# EAGLE design counter (EAGLE 9.6.2)
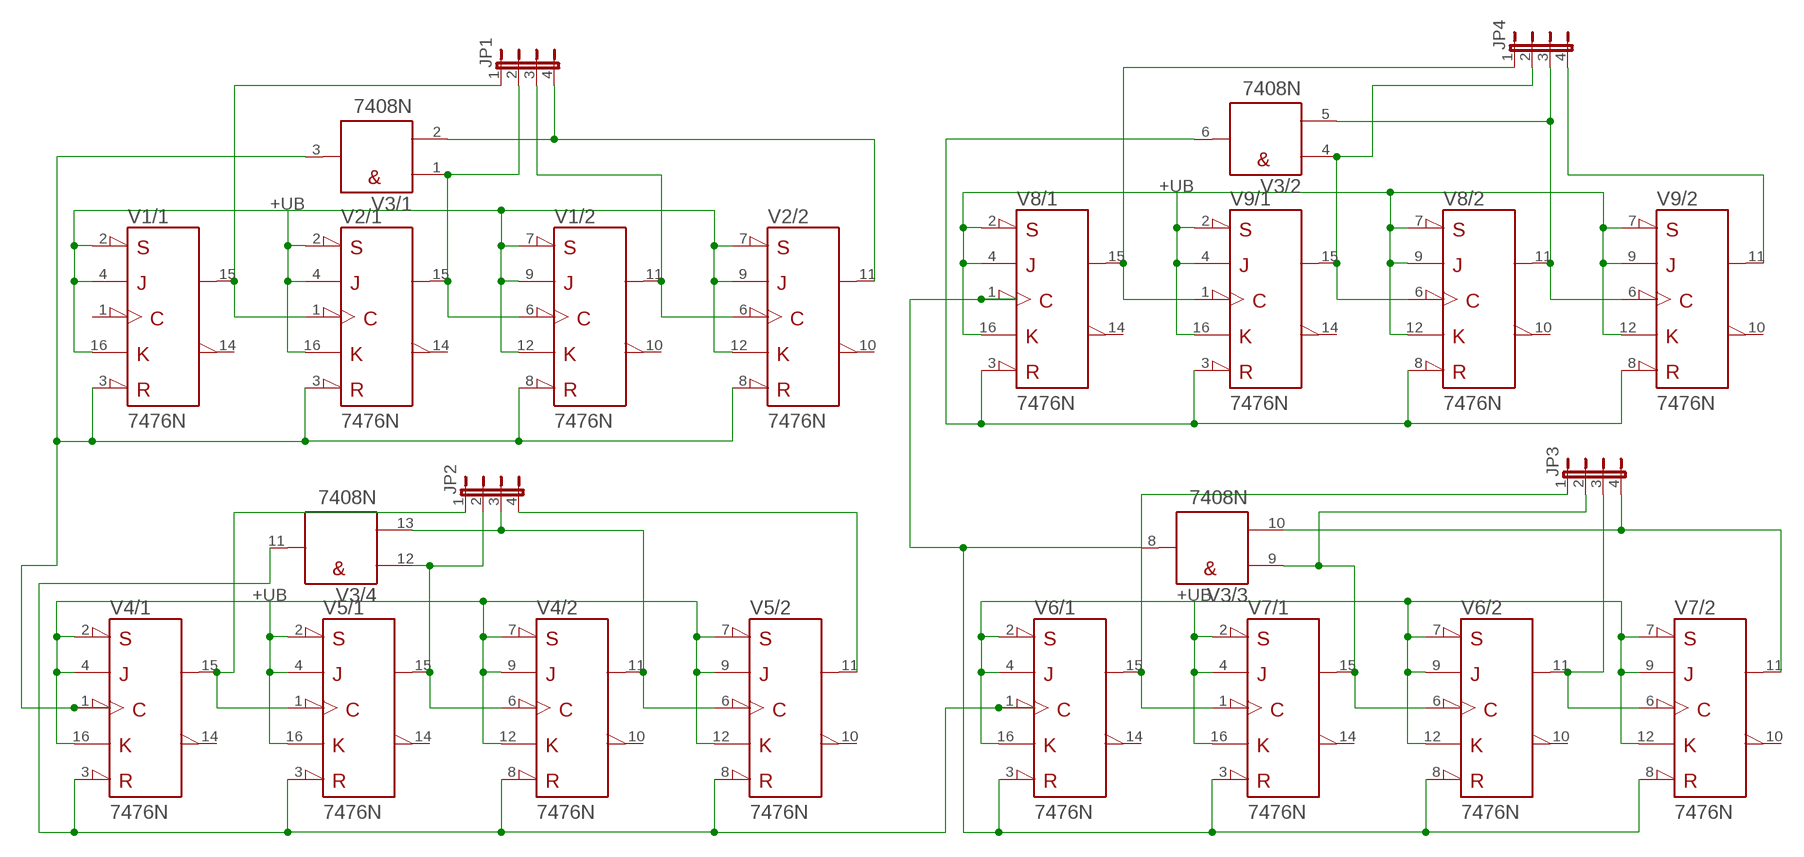
[diagram p0: schematic, sheet 1]

## Parts
JP1  JP4E  [JP4]
JP2  JP4E  [JP4]
JP3  JP4E  [JP4]
JP4  JP4E  [JP4]
V1  7476N  [DIL16]
V2  7476N  [DIL16]
V3  7408N  [DIL14]
V4  7476N  [DIL16]
V5  7476N  [DIL16]
V6  7476N  [DIL16]
V7  7476N  [DIL16]
V8  7476N  [DIL16]
V9  7476N  [DIL16]

## Nets
+UB: V1.2(/1:!PRE) V1.4(/1:J) V1.7(/2:!PRE) V1.9(/2:J) V1.12(/2:K) V1.16(/1:K) V2.2(/1:!PRE) V2.4(/1:J) V2.7(/2:!PRE) V2.9(/2:J) V2.12(/2:K) V2.16(/1:K) V4.2(/1:!PRE) V4.4(/1:J) V4.7(/2:!PRE) V4.9(/2:J) V4.12(/2:K) V4.16(/1:K) V5.2(/1:!PRE) V5.4(/1:J) V5.7(/2:!PRE) V5.9(/2:J) V5.12(/2:K) V5.16(/1:K) V6.2(/1:!PRE) V6.4(/1:J) V6.7(/2:!PRE) V6.9(/2:J) V6.12(/2:K) V6.16(/1:K) V7.2(/1:!PRE) V7.4(/1:J) V7.7(/2:!PRE) V7.9(/2:J) V7.12(/2:K) V7.16(/1:K) V8.2(/1:!PRE) V8.4(/1:J) V8.7(/2:!PRE) V8.9(/2:J) V8.12(/2:K) V8.16(/1:K) V9.2(/1:!PRE) V9.4(/1:J) V9.7(/2:!PRE) V9.9(/2:J) V9.12(/2:K) V9.16(/1:K)
N$1: JP1.1 V1.15(/1:Q) V2.1(/1:CLK)
N$2: JP1.2 V1.6(/2:CLK) V2.15(/1:Q) V3.1(/1:A)
N$3: V1.3(/1:!CLR) V1.8(/2:!CLR) V2.3(/1:!CLR) V2.8(/2:!CLR) V3.3(/1:Y) V4.1(/1:CLK)
N$4: JP1.3 V1.11(/2:Q) V2.6(/2:CLK)
N$5: JP1.4 V2.11(/2:Q) V3.2(/1:B)
N$6: JP3.4 V3.10(/3:B) V7.11(/2:Q)
N$7: V3.11(/4:Y) V4.3(/1:!CLR) V4.8(/2:!CLR) V5.3(/1:!CLR) V5.8(/2:!CLR) V6.1(/1:CLK)
N$8: JP2.1 V4.15(/1:Q) V5.1(/1:CLK)
N$9: JP2.2 V3.12(/4:A) V4.6(/2:CLK) V5.15(/1:Q)
N$10: JP2.3 V3.13(/4:B) V4.11(/2:Q) V5.6(/2:CLK)
N$11: JP2.4 V5.11(/2:Q)
N$12: V3.6(/2:Y) V8.3(/1:!CLR) V8.8(/2:!CLR) V9.3(/1:!CLR) V9.8(/2:!CLR)
N$13: V3.8(/3:Y) V6.3(/1:!CLR) V6.8(/2:!CLR) V7.3(/1:!CLR) V7.8(/2:!CLR) V8.1(/1:CLK)
N$14: JP3.1 V6.15(/1:Q) V7.1(/1:CLK)
N$15: JP3.2 V3.9(/3:A) V6.6(/2:CLK) V7.15(/1:Q)
N$16: JP3.3 V6.11(/2:Q) V7.6(/2:CLK)
N$17: JP4.1 V8.15(/1:Q) V9.1(/1:CLK)
N$18: JP4.4 V9.11(/2:Q)
N$19: JP4.3 V3.5(/2:B) V8.11(/2:Q) V9.6(/2:CLK)
N$23: JP4.2 V3.4(/2:A) V8.6(/2:CLK) V9.15(/1:Q)
Unconnected: V1.1(/1:CLK) V1.10(/2:!Q) V1.14(/1:!Q) V2.10(/2:!Q) V2.14(/1:!Q) V4.10(/2:!Q) V4.14(/1:!Q) V5.10(/2:!Q) V5.14(/1:!Q) V6.10(/2:!Q) V6.14(/1:!Q) V7.10(/2:!Q) V7.14(/1:!Q) V8.10(/2:!Q) V8.14(/1:!Q) V9.10(/2:!Q) V9.14(/1:!Q)

## Power pins joined to a net without a drawn wire
+UB: V1.5(/+UB:+UB) V2.5(/+UB:+UB) V3.14(/+UB:+UB) V4.5(/+UB:+UB) V5.5(/+UB:+UB) V6.5(/+UB:+UB) V7.5(/+UB:+UB) V8.5(/+UB:+UB) V9.5(/+UB:+UB)
-UB: V1.13(/-UB:-UB) V2.13(/-UB:-UB) V3.7(/-UB:-UB) V4.13(/-UB:-UB) V5.13(/-UB:-UB) V6.13(/-UB:-UB) V7.13(/-UB:-UB) V8.13(/-UB:-UB) V9.13(/-UB:-UB)

## Library data of the parts
JP1-JP4 = jumper:JP4E: JUMPER
V1 V2 V4-V9 = 74ttl-din:74*76: Dual J-K FLIP FLOP, preset and clear
V3 = 74ttl-din:74*08: Quad 2-input AND gate

## Board
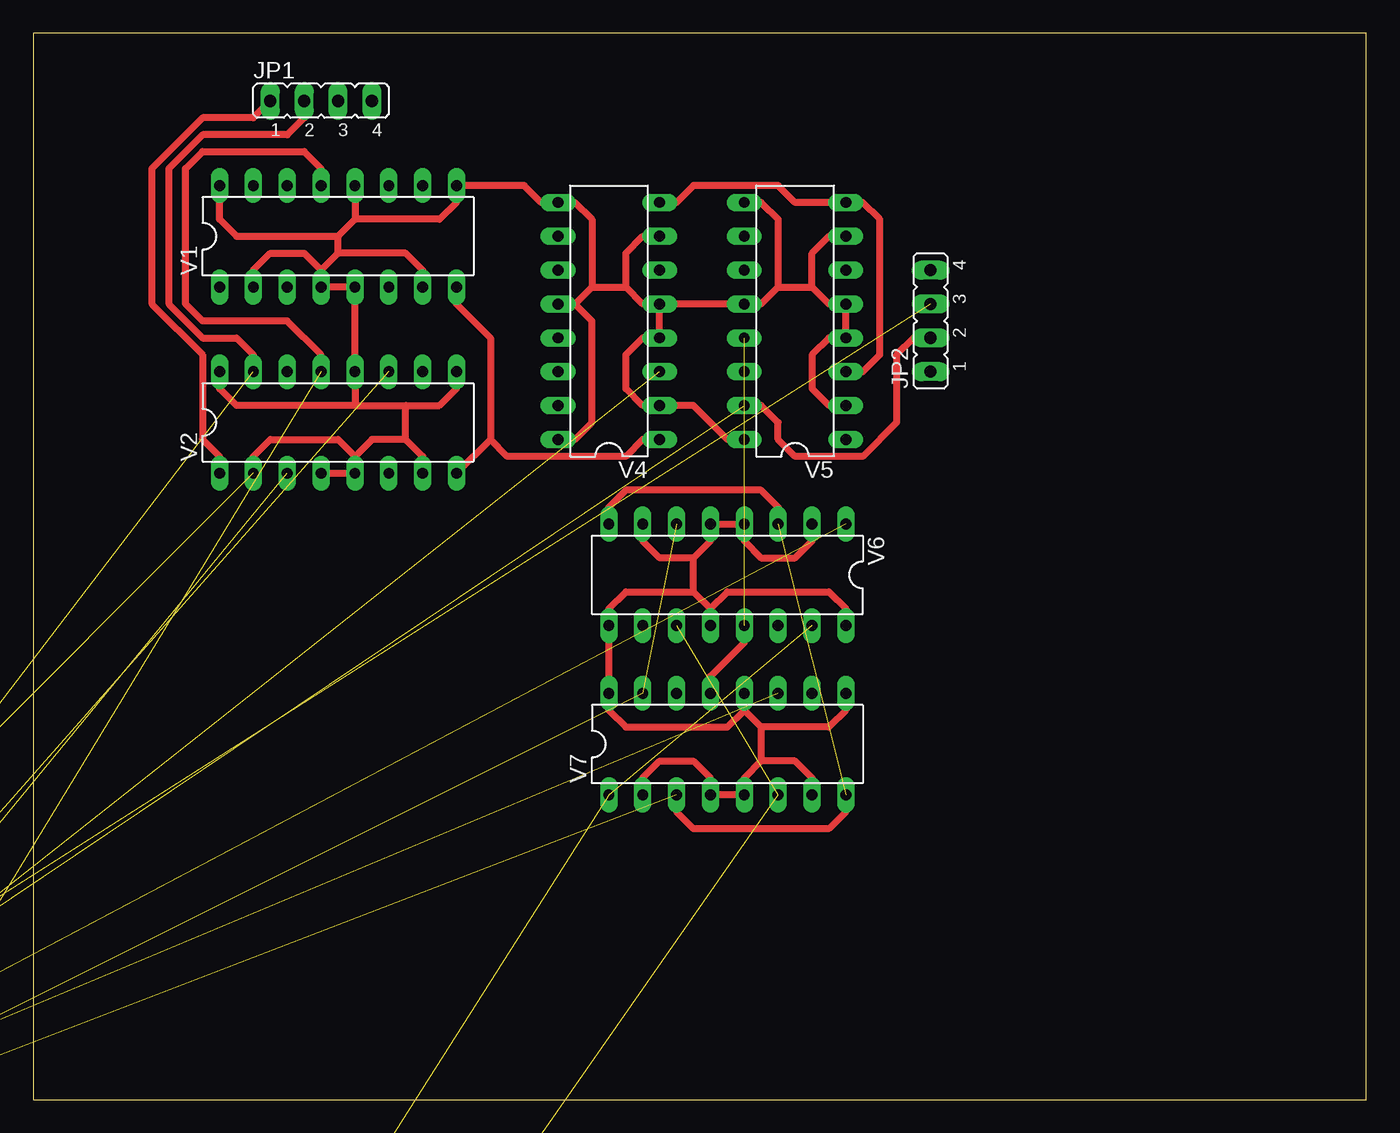
[diagram p1: board, top side]
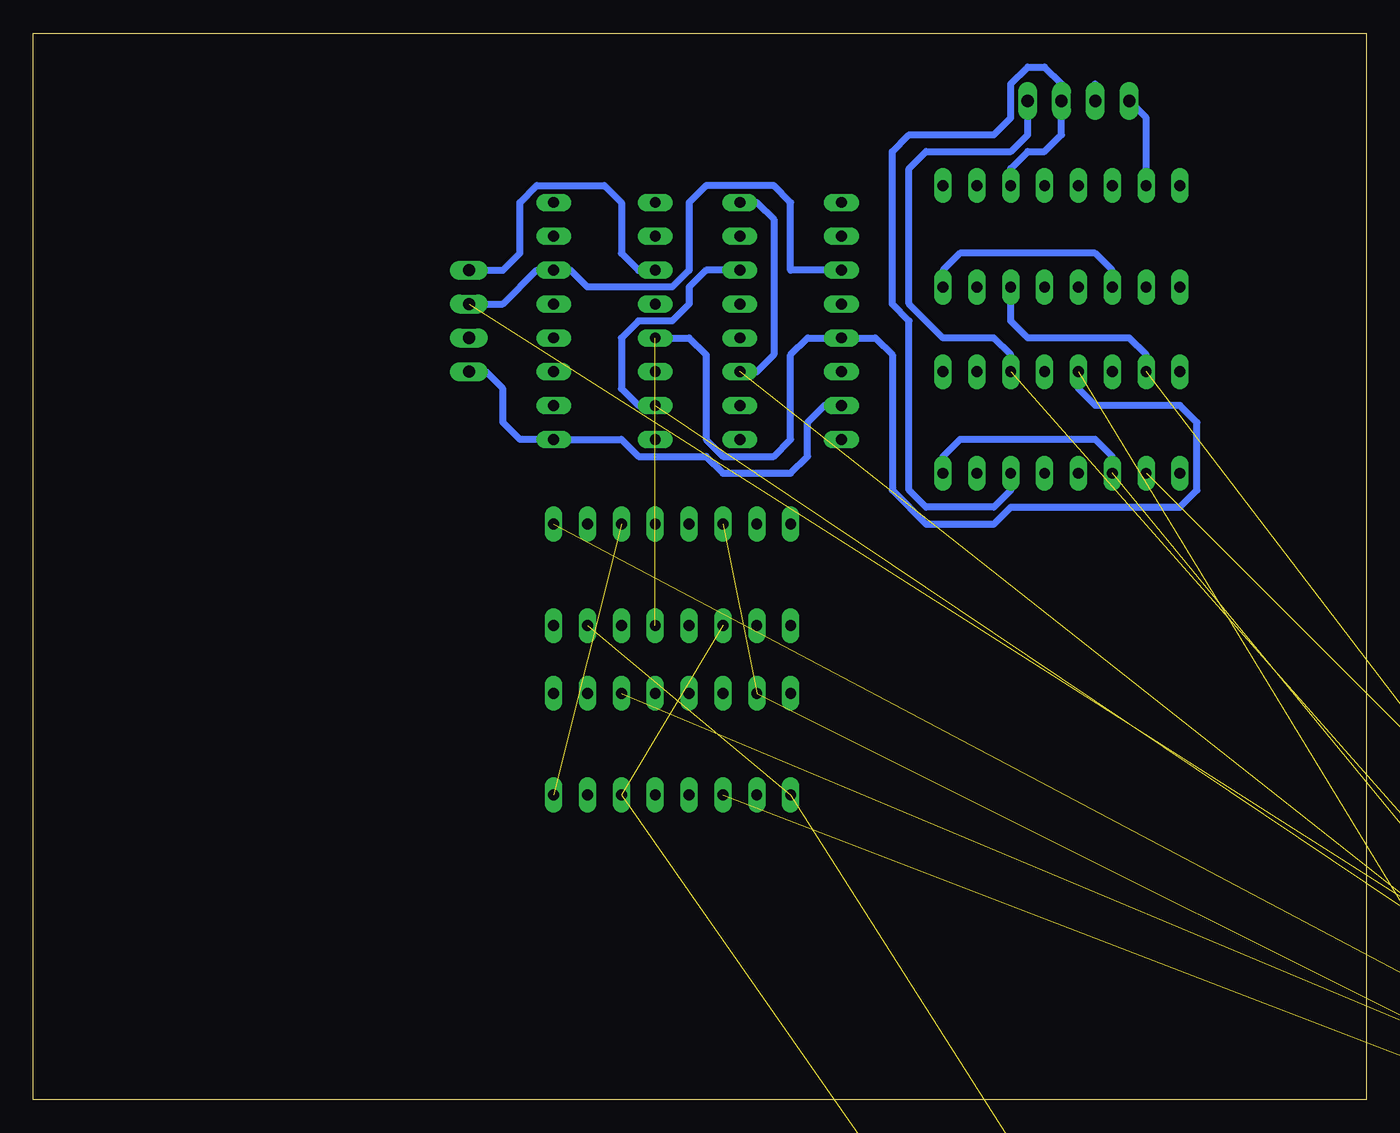
[diagram p2: board, bottom side, seen from below]

Size 100 x 80 mm. Coordinates in mm from the lower left corner, seen from the top.
Outline: 0,0 100,0 100,80 0,80 0,0
Copper layers (1*16): Top 0.035mm / dielectric 1.5mm / Bottom 0.035mm
Design rules "default": minimum track width 6mil, minimum drill 0.35mm, track to track 6mil, track to pad 6mil, pad to pad 6mil, via to via 6mil, smd to smd 6mil, copper to edge 40mil, drill to drill 6mil, minimum pad ring 10mil, minimum via ring 8mil, stop-mask expansion 4mil, vias tented up to drill 0mil, thermal gap 10mil

### Footprints (pad centres in the part's own frame; a part is rotated, then mirrored left to right if it is on the bottom)
JP4 = drill 0.914 long: 1 -3.81,0; 2 -1.27,0; 3 1.27,0; 4 3.81,0
DIL16 = drill 0.813 long: 1 -8.89,-3.81; 2 -6.35,-3.81; 3 -3.81,-3.81; 4 -1.27,-3.81; 5 1.27,-3.81; 6 3.81,-3.81; 7 6.35,-3.81; 8 8.89,-3.81; 9 8.89,3.81; 10 6.35,3.81; 11 3.81,3.81; 12 1.27,3.81; 13 -1.27,3.81; 14 -3.81,3.81; 15 -6.35,3.81; 16 -8.89,3.81
DIL14 = drill 0.813 long: 1 -7.62,-3.81; 2 -5.08,-3.81; 3 -2.54,-3.81; 4 0,-3.81; 5 2.54,-3.81; 6 5.08,-3.81; 7 7.62,-3.81; 8 7.62,3.81; 9 5.08,3.81; 10 2.54,3.81; 11 0,3.81; 12 -2.54,3.81; 13 -5.08,3.81; 14 -7.62,3.81

### Placement (x,y rotation side)
JP1  21.59,74.93 0 top
JP2  67.31,58.42 90 top
JP3  -30.48,-99.06 0 top  (outside the outline)
JP4  -30.48,-106.68 0 top  (outside the outline)
V1  22.86,64.77 0 top
V2  22.86,50.8 0 top
V3  -25.4,-6.35 0 top  (outside the outline)
V4  43.18,58.42 90 top
V5  57.15,58.42 90 top
V6  52.07,39.37 180 top
V7  52.07,26.67 0 top
V8  -24.13,-63.5 0 top  (outside the outline)
V9  -24.13,-74.93 0 top  (outside the outline)

### Tracks (layer width: path | path; a pad name or v marks a point on that pad's centre or on a via)
+UB  (16 unrouted)
  Top 0.508: 22.86,64.77 15.24,64.77 13.97,66.04 V1.16 13.97,67.31 | 22.86,64.77 24.13,66.04 | V1.12 24.13,66.04 | 21.59,62.23 V1.4 V1.5 V2.12 24.13,52.07 | V1.7 29.21,62.23 27.94,63.5 22.86,63.5 | 22.86,63.5 21.59,62.23 | 22.86,63.5 22.86,64.77 | V1.2 16.51,62.23 17.78,63.5 20.32,63.5 21.59,62.23 | 24.13,66.04 30.48,66.04 31.75,67.31 V1.9 36.83,68.58 38.1,67.31 V4.9 40.64,67.31 41.91,66.04 41.91,60.96 | 24.13,52.07 27.94,52.07 | 27.94,52.07 30.48,52.07 31.75,53.34 V2.9 | 24.13,52.07 15.24,52.07 13.97,53.34 V2.16 | V2.7 29.21,48.26 27.94,49.53 | 27.94,49.53 25.4,49.53 24.13,48.26 | 24.13,48.26 V2.5 V2.4 | V2.2 16.51,48.26 17.78,49.53 22.86,49.53 24.13,48.26 | 27.94,49.53 27.94,52.07 | V4.12 40.64,59.69 | 40.64,59.69 41.91,60.96 | V4.5 V4.4 45.72,57.15 44.45,55.88 44.45,53.34 45.72,52.07 V4.2 49.53,52.07 52.07,49.53 V5.16 | V4.5 45.72,59.69 44.45,60.96 | 44.45,60.96 44.45,63.5 45.72,64.77 V4.7 | V4.16 40.64,49.53 41.91,50.8 41.91,58.42 40.64,59.69 | 41.91,60.96 44.45,60.96 | V4.5 V5.12 54.61,59.69 55.88,60.96 | 58.42,60.96 59.69,59.69 V5.5 V5.4 59.69,57.15 58.42,55.88 58.42,53.34 59.69,52.07 V5.2 | 58.42,60.96 58.42,63.5 59.69,64.77 V5.7 | V5.9 54.61,67.31 55.88,66.04 55.88,60.96 | 55.88,60.96 58.42,60.96 | V6.2 58.42,41.91 57.15,40.64 54.61,40.64 53.34,41.91 V6.4 V6.5 50.8,41.91 49.53,40.64 | 49.53,40.64 46.99,40.64 45.72,41.91 V6.7 | V6.12 50.8,36.83 | 50.8,36.83 52.07,38.1 59.69,38.1 60.96,36.83 V6.16 | 49.53,38.1 44.45,38.1 43.18,36.83 V6.9 V7.16 43.18,29.21 44.45,27.94 52.07,27.94 53.34,29.21 | 49.53,38.1 50.8,36.83 | 49.53,38.1 49.53,40.64 | V7.7 58.42,24.13 57.15,25.4 54.61,25.4 | 54.61,25.4 53.34,24.13 V7.5 V7.4 50.8,24.13 49.53,25.4 46.99,25.4 45.72,24.13 V7.2
  Top 0.508: 53.34,29.21 V7.12 | V7.9 60.96,29.21 59.69,27.94 54.61,27.94 | 54.61,27.94 53.34,29.21 | 54.61,27.94 54.61,25.4
-UB  (4 unrouted)
  Top 0.508: V2.13 21.59,55.88 19.05,58.42 12.7,58.42 11.43,59.69 11.43,69.85 12.7,71.12 20.32,71.12 21.59,69.85 V1.13 | V7.13 50.8,31.75 53.34,34.29 V6.13
  Bottom 0.508: V2.13 21.59,53.34 20.32,52.07 13.97,52.07 12.7,50.8 12.7,45.72 13.97,44.45 26.67,44.45 27.94,43.18 33.02,43.18 35.56,45.72 35.56,55.88 36.83,57.15 V4.13 41.91,57.15 43.18,55.88 43.18,49.53 44.45,48.26 48.26,48.26 49.53,49.53 49.53,55.88 50.8,57.15 V5.13
N$1
  Top 0.508: JP1.1 16.51,73.66 12.7,73.66 8.89,69.85 8.89,59.69 12.7,55.88 12.7,49.53 13.97,48.26 V2.1
  Bottom 0.508: JP1.1 16.51,73.66 V1.15
N$2  (1 unrouted)
  Top 0.508: JP1.2 20.32,73.66 19.05,72.39 12.7,72.39 10.16,69.85 10.16,59.69 12.7,57.15 15.24,57.15 16.51,55.88 V2.15
  Bottom 0.508: V2.15 16.51,55.88 17.78,57.15 25.4,57.15 26.67,58.42 V1.6 | JP1.2 20.32,76.2
N$3  (1 unrouted)
  Top 0.508: V1.8 31.75,59.69 34.29,57.15 34.29,49.53 | 34.29,49.53 V2.8 | V4.1 45.72,49.53 44.45,48.26 35.56,48.26 34.29,49.53
  Bottom 0.508: V1.3 19.05,62.23 20.32,63.5 30.48,63.5 31.75,62.23 V1.8 | V2.3 19.05,48.26 20.32,49.53 30.48,49.53 31.75,48.26 V2.8
N$4
  Bottom 0.508: V1.11 26.67,69.85 25.4,71.12 24.13,71.12 22.86,72.39 JP1.3 22.86,76.2 24.13,77.47 25.4,77.47 26.67,76.2 26.67,73.66 27.94,72.39 34.29,72.39 35.56,71.12 35.56,59.69 34.29,58.42 34.29,45.72 33.02,44.45 27.94,44.45 26.67,45.72 V2.6
N$5  (1 unrouted)
  Bottom 0.508: V2.11 26.67,55.88 27.94,57.15 31.75,57.15 34.29,59.69 34.29,69.85 33.02,71.12 26.67,71.12 25.4,72.39 JP1.4
N$6  (2 unrouted)
N$7  (2 unrouted)
  Top 0.508: V5.3 62.23,54.61 63.5,55.88 63.5,66.04 62.23,67.31 V5.8 57.15,67.31 55.88,68.58 49.53,68.58 48.26,67.31 V4.8
  Bottom 0.508: V4.8 45.72,67.31 44.45,66.04 44.45,55.88 45.72,54.61 V4.3
N$8
  Bottom 0.508: JP2.1 66.04,54.61 64.77,53.34 64.77,50.8 63.5,49.53 V5.1 55.88,49.53 54.61,48.26 49.53,48.26 48.26,46.99 43.18,46.99 41.91,48.26 41.91,50.8 40.64,52.07 V4.15
N$9  (1 unrouted)
  Top 0.508: V5.15 54.61,52.07 55.88,50.8 55.88,49.53 57.15,48.26 62.23,48.26 64.77,50.8 64.77,55.88 66.04,57.15 JP2.2
  Bottom 0.508: V4.6 49.53,62.23 50.8,60.96 50.8,59.69 52.07,58.42 54.61,58.42 55.88,57.15 55.88,53.34 54.61,52.07 V5.15
N$10  (1 unrouted)
  Bottom 0.508: 66.04,59.69 JP2.3 64.77,59.69 62.23,62.23 V5.6 59.69,62.23 58.42,60.96 52.07,60.96 50.8,62.23 50.8,67.31 49.53,68.58 44.45,68.58 43.18,67.31 43.18,62.23 V4.11
N$11
  Bottom 0.508: JP2.4 64.77,62.23 63.5,63.5 63.5,67.31 62.23,68.58 57.15,68.58 55.88,67.31 55.88,63.5 54.61,62.23 V5.11
N$12  (4 unrouted)
N$13  (3 unrouted)
  Top 0.508: V7.8 60.96,21.59 59.69,20.32 49.53,20.32 48.26,21.59 V7.3 | V6.3 55.88,44.45 54.61,45.72 44.45,45.72 43.18,44.45 V6.8
N$14  (2 unrouted)
N$15  (3 unrouted)
N$16  (2 unrouted)
N$17  (2 unrouted)
N$18  (1 unrouted)
N$19  (3 unrouted)
N$23  (3 unrouted)